# Altium schematic sheet 1 - Top.SchDoc
size A3; PageSetup: Record=PageOptions|CenterHorizontal=True|CenterVertical=True|PrintScale=0.71|XCorrection=1.00|YCorrection=1.00|PrintKind=0|BorderSize=5000000|LeftOffset=0|BottomOffset=0|Orientation=2|PaperLength=2970|PaperWidth=2100|Scale=100|PaperSource=7|PrintQuality=-4|MediaType=1|DitherType=10|PaperKind=A4 (210 x 297 mm)|PrintScaleMode=1
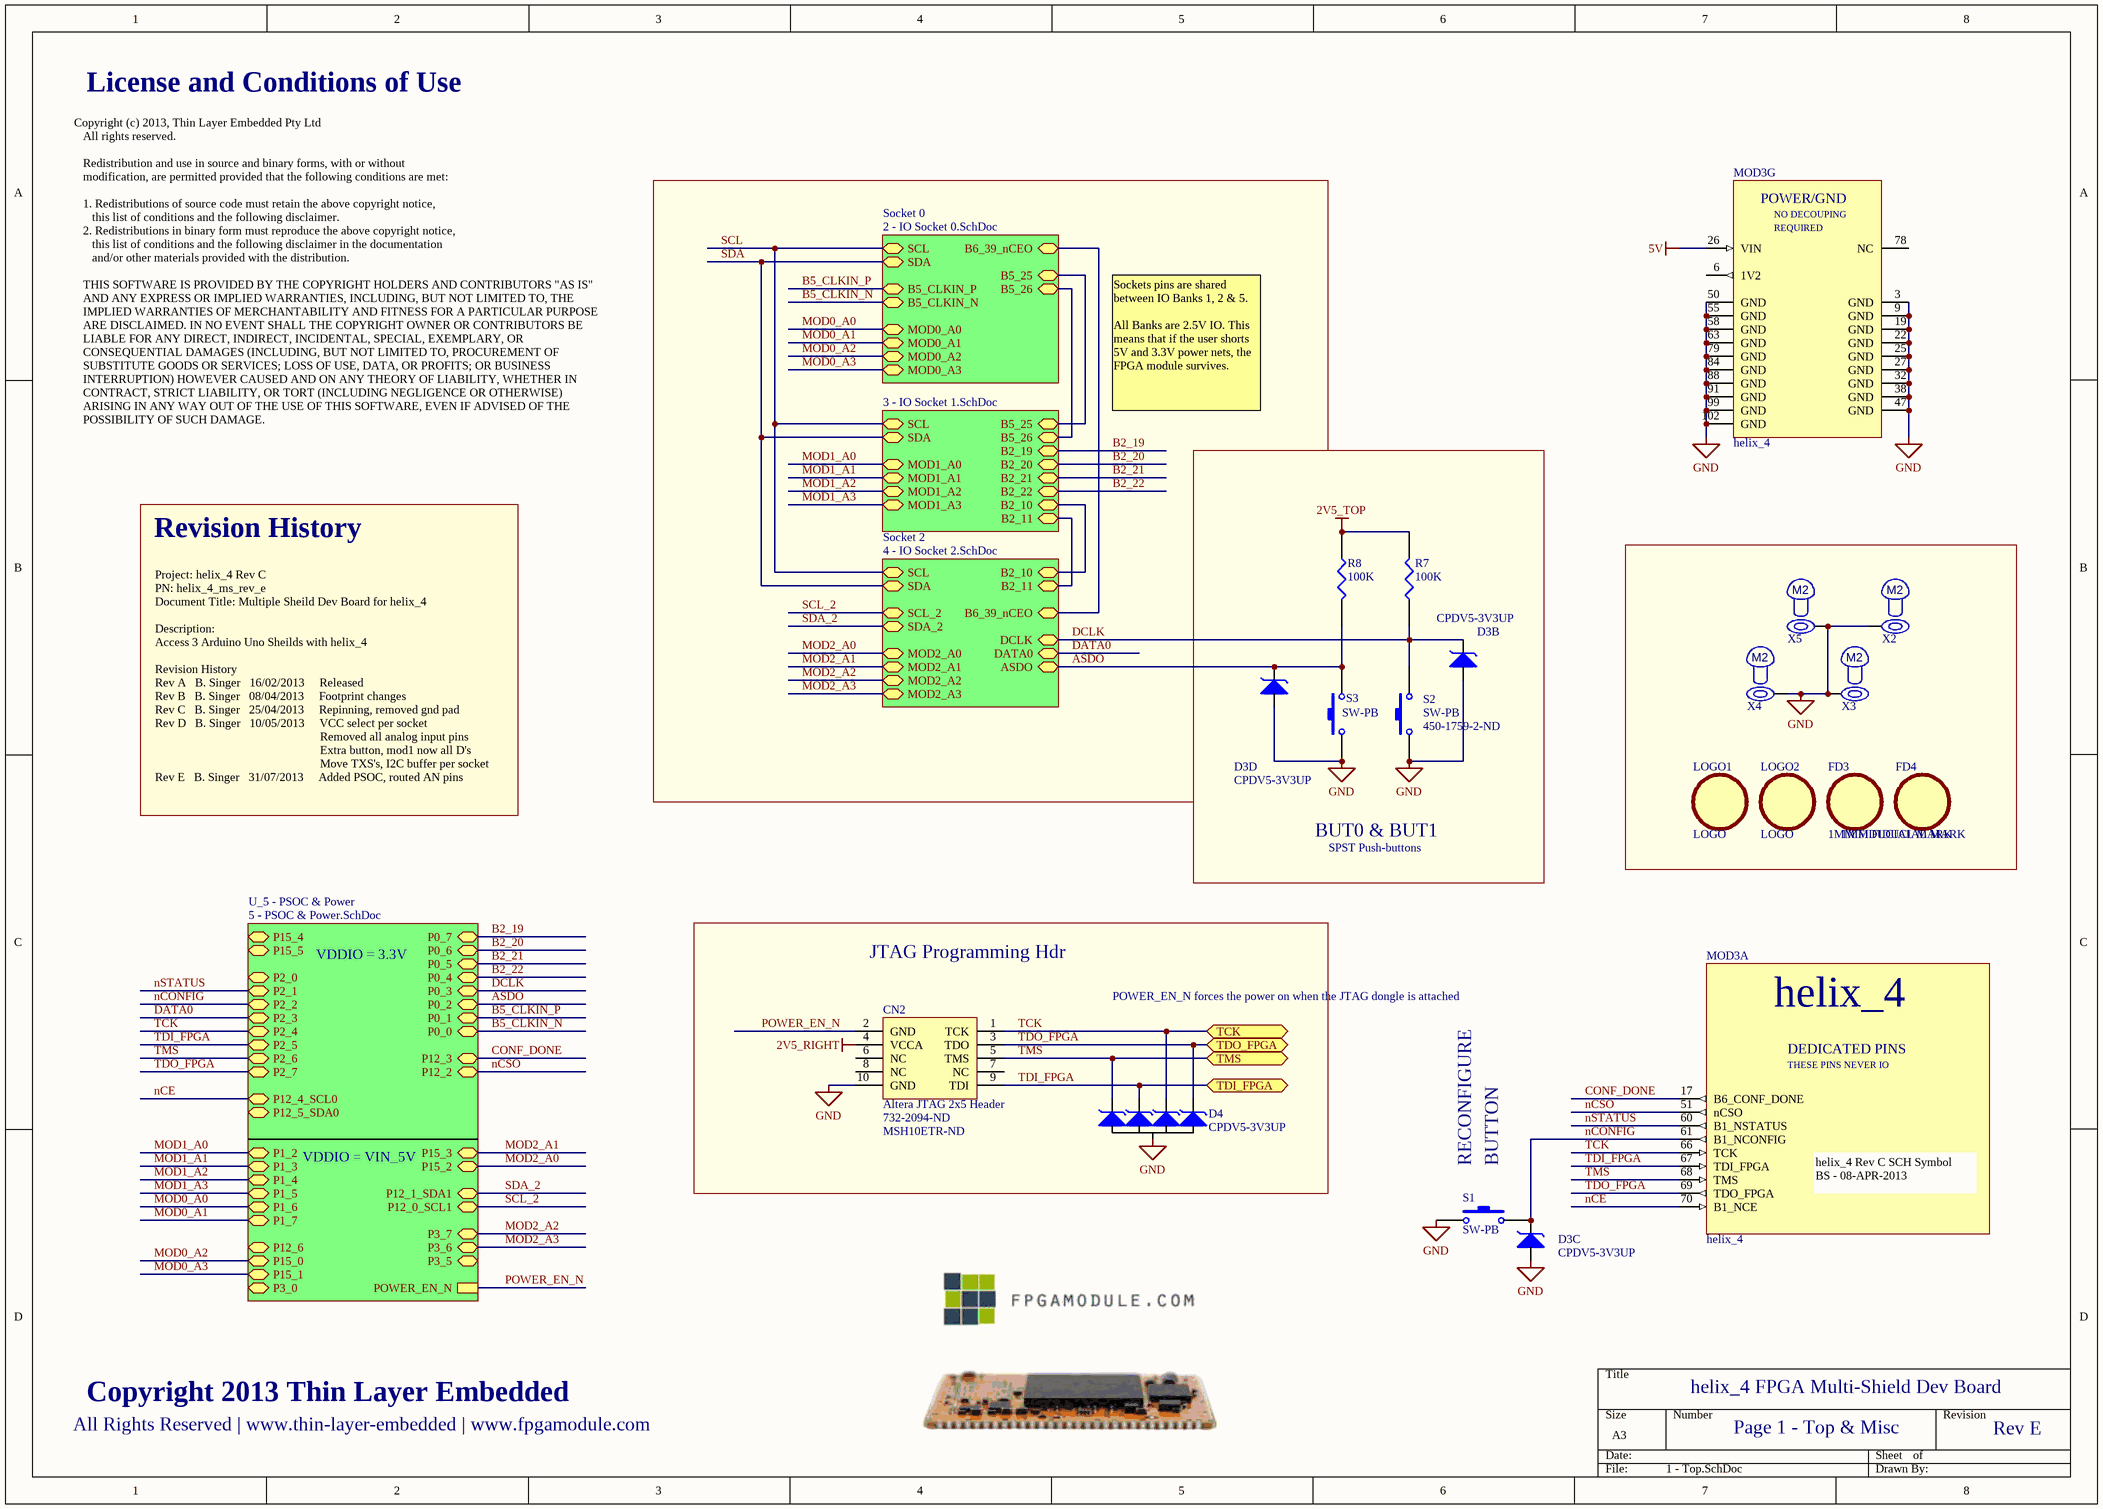
[diagram p0: 1 - Top.SchDoc]

## Parts
CN2  Altera JTAG 2x5 Header  Supplier Part Number 1: 732-2094-ND  Supplier Part Number 2: MSH10ETR-ND  [BOXHDR2X5]
D3  CPDV5-3V3UP  [sot-353]  (parts B,C,D of 4)
D4  CPDV5-3V3UP  [SOT-353]
FD3  1MM FIDUCIAL MARK  [FID_1MM]
FD4  1MM FIDUCIAL MARK  [FID_1MM]
LOGO1  LOGO  [LOGO_LARGE]
LOGO2  LOGO  [LOGO_LARGE]
MOD3  helix_4  [HELIX_4_LCC104_HOST]  (parts A,G of 7)
R7  100K  [0805]
R8  100K  [0805]
S1  SW-PB  [FSM4JSMA]
S2  SW-PB  [FSM4JSMA]
S3  SW-PB  Supplier Part Number 1: 450-1759-2-ND  [FSM4JSMA]
X2  M2 Mounting Hole  [Mounting_Hole_M3]  (value not drawn)
X3  M2 Mounting Hole  [Mounting_Hole_M3]  (value not drawn)
X4  M2 Mounting Hole  [Mounting_Hole_M3]  (value not drawn)
X5  M2 Mounting Hole  [Mounting_Hole_M3]  (value not drawn)

## Blocks framed on the sheet
BUT0 & BUT1: D3 R7 R8 S2 S3
JTAG Programming Hdr: CN2 D4

## Sub-sheets
Socket 0 = 2 - IO Socket 0.SchDoc: SCL, SDA, B5_25, B5_26, B6_39_nCEO, B5_CLKIN_P, B5_CLKIN_N, MOD0_A0, MOD0_A1, MOD0_A2, MOD0_A3
Socket 1 = 3 - IO Socket 1.SchDoc: SDA, SCL, B5_26, B5_25, MOD1_A0, MOD1_A1, MOD1_A2, MOD1_A3, B2_10, B2_11, B2_19, B2_20, B2_21, B2_22
Socket 2 = 4 - IO Socket 2.SchDoc: SDA, SCL, DCLK, DATA0, B6_39_nCEO, ASDO, MOD2_A0, MOD2_A1, MOD2_A2, MOD2_A3, SDA_2, SCL_2, B2_10, B2_11
U_5 - PSOC & Power = 5 - PSOC & Power.SchDoc: P15_4, P15_5, P12_6, P2_0, P1_5, P1_6, P1_7, P2_1, P2_2, P2_3, P2_4, P2_5, P2_6, P2_7, P12_3, P12_2, POWER_EN_N, P0_0, P1_4, P1_3, P12_4_SCL0, P12_5_SDA0, P12_1_SDA1, P12_0_SCL1, P1_2, P0_1, P0_2, P0_3, P0_4, P0_5, P0_6, P0_7, P3_5, P3_6, P3_7, P15_0, P15_2, P15_3, P15_1, P3_0

## Ports
TCK, TDI_FPGA, TDO_FPGA, TMS

## Nets
2V5_RIGHT: CN2.4(VCCA)
2V5_TOP: R7.1 R8.1
5V: MOD3.26(VIN)
GND: CN2.10(GND) D3.2(A) D4.2(A) MOD3.3(GND) MOD3.9(GND) MOD3.19(GND) MOD3.22(GND) MOD3.25(GND) MOD3.27(GND) MOD3.32(GND) MOD3.38(GND) MOD3.47(GND) MOD3.50(GND) MOD3.55(GND) MOD3.58(GND) MOD3.63(GND) MOD3.79(GND) MOD3.84(GND) MOD3.88(GND) MOD3.91(GND) MOD3.99(GND) MOD3.102(GND) S1.1 S2.1 S3.1 X2.1 X3.1 X4.1 X5.1
ASDO: D3.4(K4) R8.2 S3.2 ; sheet Socket 2/ASDO, sheet U_5 - PSOC & Power/P0_2
B2_19: sheet Socket 1/B2_19, sheet U_5 - PSOC & Power/P0_7
B2_20: sheet Socket 1/B2_20, sheet U_5 - PSOC & Power/P0_6
B2_21: sheet Socket 1/B2_21, sheet U_5 - PSOC & Power/P0_5
B2_22: sheet Socket 1/B2_22, sheet U_5 - PSOC & Power/P0_4
B5_CLKIN_N: sheet Socket 0/B5_CLKIN_N, sheet U_5 - PSOC & Power/P0_0
B5_CLKIN_P: sheet Socket 0/B5_CLKIN_P, sheet U_5 - PSOC & Power/P0_1
CONF_DONE: MOD3.17(B6_CONF_DONE) ; sheet U_5 - PSOC & Power/P12_3
DATA0: sheet Socket 2/DATA0, sheet U_5 - PSOC & Power/P2_3
DCLK: D3.1(K2) R7.2 S2.2 ; sheet Socket 2/DCLK, sheet U_5 - PSOC & Power/P0_3
MOD0_A0: sheet Socket 0/MOD0_A0, sheet U_5 - PSOC & Power/P1_6
MOD0_A1: sheet Socket 0/MOD0_A1, sheet U_5 - PSOC & Power/P1_7
MOD0_A2: sheet Socket 0/MOD0_A2, sheet U_5 - PSOC & Power/P15_0
MOD0_A3: sheet Socket 0/MOD0_A3, sheet U_5 - PSOC & Power/P15_1
MOD1_A0: sheet Socket 1/MOD1_A0, sheet U_5 - PSOC & Power/P1_2
MOD1_A1: sheet Socket 1/MOD1_A1, sheet U_5 - PSOC & Power/P1_3
MOD1_A2: sheet Socket 1/MOD1_A2, sheet U_5 - PSOC & Power/P1_4
MOD1_A3: sheet Socket 1/MOD1_A3, sheet U_5 - PSOC & Power/P1_5
MOD2_A0: sheet Socket 2/MOD2_A0, sheet U_5 - PSOC & Power/P15_2
MOD2_A1: sheet Socket 2/MOD2_A1, sheet U_5 - PSOC & Power/P15_3
MOD2_A2: sheet Socket 2/MOD2_A2, sheet U_5 - PSOC & Power/P3_7
MOD2_A3: sheet Socket 2/MOD2_A3, sheet U_5 - PSOC & Power/P3_6
nCE: MOD3.70(B1_NCE) ; sheet U_5 - PSOC & Power/P12_4_SCL0
nCONFIG: D3.5(K3) MOD3.61(B1_NCONFIG) S1.2 ; sheet U_5 - PSOC & Power/P2_2
nCSO: MOD3.51(nCSO) ; sheet U_5 - PSOC & Power/P12_2
nSTATUS: MOD3.60(B1_NSTATUS) ; sheet U_5 - PSOC & Power/P2_1
POWER_EN_N: CN2.2(GND) ; sheet U_5 - PSOC & Power/POWER_EN_N
SCL: sheet Socket 1/SCL, sheet Socket 0/SCL, sheet Socket 2/SCL
SCL_2: sheet Socket 2/SCL_2, sheet U_5 - PSOC & Power/P12_0_SCL1
SDA: sheet Socket 1/SDA, sheet Socket 0/SDA, sheet Socket 2/SDA
SDA_2: sheet Socket 2/SDA_2, sheet U_5 - PSOC & Power/P12_1_SDA1
TCK: CN2.1(TCK) D4.5(K1) MOD3.66(TCK) ; port TCK, sheet U_5 - PSOC & Power/P2_4
TDI_FPGA: CN2.9(TDI) D4.1(K2) MOD3.67(TDI_FPGA) ; port TDI_FPGA, sheet U_5 - PSOC & Power/P2_5
TDO_FPGA: CN2.3(TDO) D4.4(K2) MOD3.69(TDO_FPGA) ; port TDO_FPGA, sheet U_5 - PSOC & Power/P2_7
TMS: CN2.5(TMS) D4.3(K1) MOD3.68(TMS) ; port TMS, sheet U_5 - PSOC & Power/P2_6
(unnamed): sheet Socket 1/B5_26, sheet Socket 0/B5_26
(unnamed): sheet Socket 1/B5_25, sheet Socket 0/B5_25
(unnamed): sheet Socket 1/B2_10, sheet Socket 2/B2_10
(unnamed): sheet Socket 1/B2_11, sheet Socket 2/B2_11
(unnamed): sheet Socket 0/B6_39_nCEO, sheet Socket 2/B6_39_nCEO

Not connected (* = marked no-connect by the designer): CN2 6(NC) 7(NC) 8(NC); FD3 1(FID); FD4 1(FID); LOGO1 1(FID); LOGO2 1(FID); MOD3 6(1V2) 78(NC)

## Notes on the sheet
- License and Conditions of Use
- Sockets pins are shared between IO Banks 1, 2 & 5.
  All Banks are 2.5V IO. This means that if the user shorts 5V and 3.3V power nets, the FPGA module survives.
- Copyright (c) 2013, Thin Layer Embedded Pty Ltd
  All rights reserved.
  Redistribution and use in source and binary forms, with or without
  modification, are permitted provided that the following conditions are met:
  1. Redistributions of source code must retain the above copyright notice,
  this list of conditions and the following disclaimer.
  2. Redistributions in binary form must reproduce the above copyright notice,
  this list of conditions and the following disclaimer in the documentation
  and/or other materials provided with the distribution.
  THIS SOFTWARE IS PROVIDED BY THE COPYRIGHT HOLDERS AND CONTRIBUTORS "AS IS"
  AND ANY EXPRESS OR IMPLIED WARRANTIES, INCLUDING, BUT NOT LIMITED TO, THE
  IMPLIED WARRANTIES OF MERCHANTABILITY AND FITNESS FOR A PARTICULAR PURPOSE
  ARE DISCLAIMED. IN NO EVENT SHALL THE COPYRIGHT OWNER OR CONTRIBUTORS BE
  LIABLE FOR ANY DIRECT, INDIRECT, INCIDENTAL, SPECIAL, EXEMPLARY, OR
  CONSEQUENTIAL DAMAGES (INCLUDING, BUT NOT LIMITED TO, PROCUREMENT OF
  SUBSTITUTE GOODS OR SERVICES; LOSS OF USE, DATA, OR PROFITS; OR BUSINESS
  INTERRUPTION) HOWEVER CAUSED AND ON ANY THEORY OF LIABILITY, WHETHER IN
  CONTRACT, STRICT LIABILITY, OR TORT (INCLUDING NEGLIGENCE OR OTHERWISE)
  ARISING IN ANY WAY OUT OF THE USE OF THIS SOFTWARE, EVEN IF ADVISED OF THE
  POSSIBILITY OF SUCH DAMAGE.
- Revision History
- Project: helix_4 Rev C
  PN: helix_4_ms_rev_e
  Document Title: Multiple Sheild Dev Board for helix_4
  Description:
  Access 3 Arduino Uno Sheilds with helix_4
  Revision History
  Rev A   B. Singer   16/02/2013     Released
  Rev B   B. Singer   08/04/2013     Footprint changes
  Rev C   B. Singer   25/04/2013     Repinning, removed gnd pad
  Rev D   B. Singer   10/05/2013     VCC select per socket
  Removed all analog input pins
  Extra button, mod1 now all D's
  Move TXS's, I2C buffer per socket
  Rev E   B. Singer   31/07/2013     Added PSOC, routed AN pins
- SPST Push-buttons
- VDDIO = 3.3V
- (near CN2) POWER_EN_N forces the power on when the JTAG dongle is attached
- VDDIO = VIN_5V
- RECONFIGURE
- BUTTON
- helix_4 FPGA Multi-Shield Dev Board
- All Rights Reserved | www.thin-layer-embedded | www.fpgamodule.com
- Copyright 2013 Thin Layer Embedded
- Page 1 - Top & Misc
- Rev E
- (in symbol helix_4 Rev C Module, part A) DEDICATED PINS; THESE PINS NEVER IO; helix_4 Rev C SCH Symbol / BS - 08-APR-2013 /
- (in symbol helix_4 Rev C Module, part G) POWER/GND; NO DECOUPING; REQUIRED
- (in symbol Mounting_Hole_M2) M2

## Library data of the parts
CN2 = Altera JTAG 2x5 Header: Header, 5-Pin, Dual row; Manufacturer: Wurth Electronics Inc; Manufacturer Part Number: 61201021621; Description: BOX HEADER 2.54MM MALE STR 10POS; Connector Type: Header, Shrouded; Number of Positions: 10; Number of Positions Loaded: All; Pitch: 0.100" (2.54mm); LatestRevisionDate: 17-Jul-2002; LatestRevisionNote: Re-released for DXP Platform.; Publisher: Altium Limited; Supplier 1: Digi-Key; RoHS: RoHS Compliant; Category: Connectors, Interconnects; Stock 1: 324; Pricing 1: 1=0.97, 25=0.8052, 100=0.713, 250=0.63252, 500=0.575, 1000=0.46, 2500=0.4025, 5000=0.3335, 10000=0.3059 (USD); Contact Type: Male Pin; Number of Rows: 2; Row Spacing: 0.100" (2.54mm); Contact Mating Length: -; Mounting Type: Through Hole; Termination: Solder; Fastening Type: -; Features: -; Contact Finish: Gold; Contact Finish Thickness: -; Color: Black; Packaging: Tray; ComponentLink1URL: http://www.we-online.de/eican/media/pdf/6120xx21621.pdf; ComponentLink1Description: http://www.we-online.de/eican/media/pdf/6120xx21621.pdf; Supplier 2: Digi-Key
D3 = 4CH ESD DIODE (SPLIT): 4CH ESD DIODE 3V3/3.5V
D4 = 4CH ESD DIODE: 4CH ESD DIODE 3V3/3.5V
FD3 FD4 LOGO1 LOGO2 = FID
MOD3 = helix_4 Rev C Module
R7 R8 = RES1
S1-S3 = SW-PB: Switch; Published: 24-Mar-1999; LatestRevisionDate: 17-Jul-2002; LatestRevisionNote: Re-released for DXP Platform.; PackageReference: SPST-2; Publisher: Altium Limited
  S3: Supplier 1: Digi-Key
X2-X5 = Mounting_Hole_M2: Hole for M3 Screw